# EAGLE design PDB (EAGLE 9.6.2)

## Sheet 1 of 2
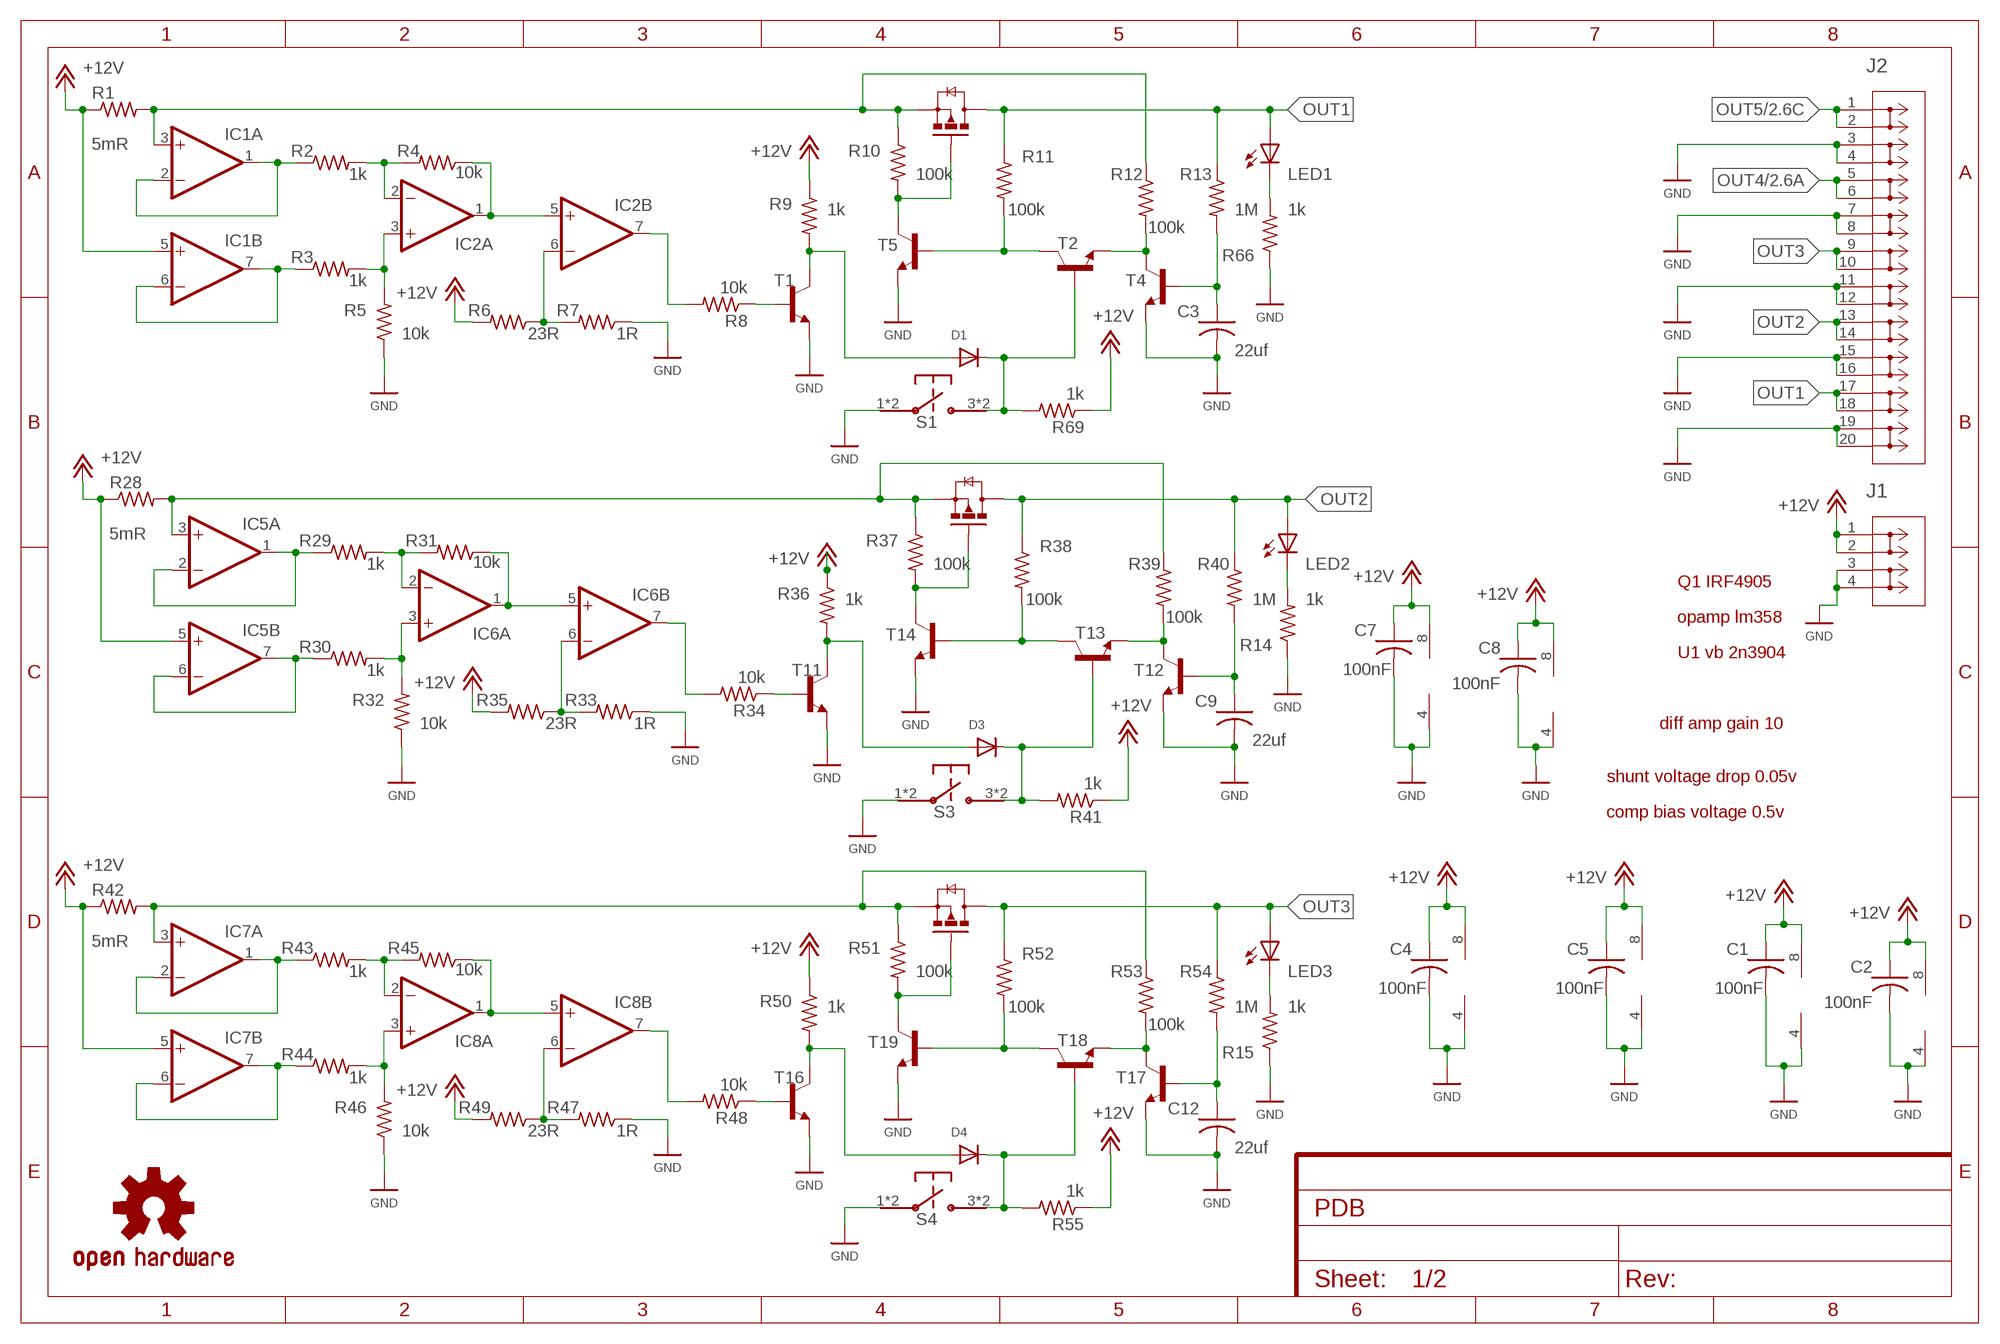
[diagram p0: schematic, sheet 1]

### Parts
C1  100nF  C-USC0603  [C0603]
C2  100nF  C-USC0603  [C0603]
C3  22uf  C-USC0805  [C0805]
C4  100nF  C-USC0603  [C0603]
C5  100nF  C-USC0603  [C0603]
C7  100nF  C-USC0603  [C0603]
C8  100nF  C-USC0603  [C0603]
C9  22uf  C-USC0805  [C0805]
C12  22uf  C-USC0805  [C0805]
D1  DIODESOD-323F  [SOD-323F]
D3  DIODESOD-323F  [SOD-323F]
D4  DIODESOD-323F  [SOD-323F]
IC1  LM358D  [SO08]
IC2  LM358D  [SO08]
IC5  LM358D  [SO08]
IC6  LM358D  [SO08]
IC7  LM358D  [SO08]
IC8  LM358D  [SO08]
J1  2606-1102  [CONN2_2606-1102_WAG]
J2  2604-1110  [CONN10_2604-1110_WAG]
LED1  LEDCHIP-LED0603  [CHIP-LED0603]
LED2  LEDCHIP-LED0603  [CHIP-LED0603]
LED3  LEDCHIP-LED0603  [CHIP-LED0603]
LOGO1  OSHW-LOGOL  [OSHW-LOGO-L]
R1  5mR  R-US_R2512  [R2512]
R2  1k  R-US_R0603  [R0603]
R3  1k  R-US_R0603  [R0603]
R4  10k  R-US_R0603  [R0603]
R5  10k  R-US_R0603  [R0603]
R6  23R  R-US_R0603  [R0603]
R7  1R  R-US_R0603  [R0603]
R8  10k  R-US_R0603  [R0603]
R9  1k  R-US_R0603  [R0603]
R10  100k  R-US_R0603  [R0603]
R11  100k  R-US_R0603  [R0603]
R12  100k  R-US_R0603  [R0603]
R13  1M  R-US_R0603  [R0603]
R14  1k  R-US_R0603  [R0603]
R15  1k  R-US_R0603  [R0603]
R28  5mR  R-US_R2512  [R2512]
R29  1k  R-US_R0603  [R0603]
R30  1k  R-US_R0603  [R0603]
R31  10k  R-US_R0603  [R0603]
R32  10k  R-US_R0603  [R0603]
R33  1R  R-US_R0603  [R0603]
R34  10k  R-US_R0603  [R0603]
R35  23R  R-US_R0603  [R0603]
R36  1k  R-US_R0603  [R0603]
R37  100k  R-US_R0603  [R0603]
R38  100k  R-US_R0603  [R0603]
R39  100k  R-US_R0603  [R0603]
R40  1M  R-US_R0603  [R0603]
R41  1k  R-US_R0603  [R0603]
R42  5mR  R-US_R2512  [R2512]
R43  1k  R-US_R0603  [R0603]
R44  1k  R-US_R0603  [R0603]
R45  10k  R-US_R0603  [R0603]
R46  10k  R-US_R0603  [R0603]
R47  1R  R-US_R0603  [R0603]
R48  10k  R-US_R0603  [R0603]
R49  23R  R-US_R0603  [R0603]
R50  1k  R-US_R0603  [R0603]
R51  100k  R-US_R0603  [R0603]
R52  100k  R-US_R0603  [R0603]
R53  100k  R-US_R0603  [R0603]
R54  1M  R-US_R0603  [R0603]
R55  1k  R-US_R0603  [R0603]
R66  1k  R-US_R0603  [R0603]
R69  1k  R-US_R0603  [R0603]
S1  PTS645SM43SMTR  [PTS645SM43SMTR]
S3  PTS645SM43SMTR  [PTS645SM43SMTR]
S4  PTS645SM43SMTR  [PTS645SM43SMTR]
T1  2N3904SMD  [SOT23-BACKUP]
T2  2N3904SMD  [SOT23-BACKUP]
T3  IRF4905  [TO263-3]
T4  2N3904SMD  [SOT23-BACKUP]
T5  2N3904SMD  [SOT23-BACKUP]
T11  2N3904SMD  [SOT23-BACKUP]
T12  2N3904SMD  [SOT23-BACKUP]
T13  2N3904SMD  [SOT23-BACKUP]
T14  2N3904SMD  [SOT23-BACKUP]
T15  IRF4905  [TO263-3]
T16  2N3904SMD  [SOT23-BACKUP]
T17  2N3904SMD  [SOT23-BACKUP]
T18  2N3904SMD  [SOT23-BACKUP]
T19  2N3904SMD  [SOT23-BACKUP]
T20  IRF4905  [TO263-3]

### Nets
+12V: C1.1 C2.1 C4.1 C5.1 C7.1 C8.1 IC1.5(B:+IN) IC1.8(P:V+) IC2.8(P:V+) IC5.5(B:+IN) IC5.8(P:V+) IC6.8(P:V+) IC7.5(B:+IN) IC7.8(P:V+) IC8.8(P:V+) J1.1(1_1) J1.2(1_2) R1.1 R6.2 R9.1 R28.1 R35.2 R36.1 R41.1 R42.1 R49.2 R50.1 R55.1 R69.1 ; also sheet 2
GND: C1.2 C2.2 C3.2 C4.2 C5.2 C7.2 C8.2 C9.2 C12.2 IC1.4(P:V-) IC2.4(P:V-) IC5.4(P:V-) IC6.4(P:V-) IC7.4(P:V-) IC8.4(P:V-) J1.3(2_1) J1.4(2_2) J2.3(2_1) J2.4(2_2) J2.7(4_1) J2.8(4_2) J2.11(6_1) J2.12(6_2) J2.15(8_1) J2.16(8_2) J2.19(10_1) J2.20(10_2) R5.1 R7.1 R14.1 R15.1 R32.1 R33.1 R46.1 R47.1 R66.1 S1.1 S1.2 S3.1 S3.2 S4.1 S4.2 T1.2(E) T4.2(E) T5.2(E) T11.2(E) T12.2(E) T14.2(E) T16.2(E) T17.2(E) T19.2(E) ; also sheet 2
N53: IC5.3(A:+IN) R28.2 R37.1 R39.1 T15.3(S)
N$1: LED2.C R14.2
N$2: IC1.1(A:OUT) IC1.2(A:-IN) R2.1
N$3: IC1.6(B:-IN) IC1.7(B:OUT) R3.1
N$4: IC2.1(A:OUT) IC2.5(B:+IN) R4.1
N$5: R8.1 T1.1(B)
N$6: IC2.7(B:OUT) R8.2
N$7: IC2.6(B:-IN) R6.1 R7.2
N$8: IC2.3(A:+IN) R3.2 R5.2
N$9: IC2.2(A:-IN) R2.2 R4.2
N$10: LED3.C R15.2
N$11: IC1.3(A:+IN) R1.2 R10.1 R12.1 T3.3(S)
N$12: R10.2 T3.1(G) T5.3(C)
N$14: R11.2 T2.3(C) T5.1(B)
N$15: C3.1 R13.2 T4.1(B)
N$18: R12.2 T2.2(E) T4.3(C)
N$27: LED1.C R66.2
N$30: IC5.1(A:OUT) IC5.2(A:-IN) R29.1
N$31: IC5.6(B:-IN) IC5.7(B:OUT) R30.1
N$32: IC6.6(B:-IN) R33.2 R35.1
N$33: IC6.3(A:+IN) R30.2 R32.2
N$34: IC6.2(A:-IN) R29.2 R31.2
N$35: IC6.1(A:OUT) IC6.5(B:+IN) R31.1
N$36: R34.1 T11.1(B)
N$37: IC6.7(B:OUT) R34.2
N$39: R37.2 T14.3(C) T15.1(G)
N$40: R38.2 T13.3(C) T14.1(B)
N$41: C9.1 R40.2 T12.1(B)
N$42: R39.2 T12.3(C) T13.2(E)
N$43: D3.C R41.2 S3.3 S3.4 T13.1(B)
N$44: D3.A R36.2 T11.3(C)
N$45: IC7.1(A:OUT) IC7.2(A:-IN) R43.1
N$46: IC7.6(B:-IN) IC7.7(B:OUT) R44.1
N$47: IC8.6(B:-IN) R47.2 R49.1
N$48: IC8.3(A:+IN) R44.2 R46.2
N$49: IC8.2(A:-IN) R43.2 R45.2
N$50: IC8.1(A:OUT) IC8.5(B:+IN) R45.1
N$51: R48.1 T16.1(B)
N$52: IC8.7(B:OUT) R48.2
N$53: IC7.3(A:+IN) R42.2 R51.1 R53.1 T20.3(S)
N$54: R51.2 T19.3(C) T20.1(G)
N$55: R52.2 T18.3(C) T19.1(B)
N$56: C12.1 R54.2 T17.1(B)
N$57: R53.2 T17.3(C) T18.2(E)
N$58: D4.C R55.2 S4.3 S4.4 T18.1(B)
N$59: D4.A R50.2 T16.3(C)
N$76: D1.C R69.2 S1.3 S1.4 T2.1(B)
N$77: D1.A R9.2 T1.3(C)
OUT1: J2.17(9_1) J2.18(9_2) LED1.A R11.1 R13.1 T3.4(D)
OUT2: J2.13(7_1) J2.14(7_2) LED2.A R38.1 R40.1 T15.4(D)
OUT3: J2.9(5_1) J2.10(5_2) LED3.A R52.1 R54.1 T20.4(D)
OUT4: J2.5(3_1) J2.6(3_2) ; also sheet 2
OUT5: J2.1(1_1) J2.2(1_2) ; also sheet 2

### Notes on the sheet
- Q1 IRF4905
- opamp lm358
- U1 vb 2n3904
- diff amp gain 10
- shunt voltage drop 0.05v
- comp bias voltage 0.5v

## Sheet 2 of 2
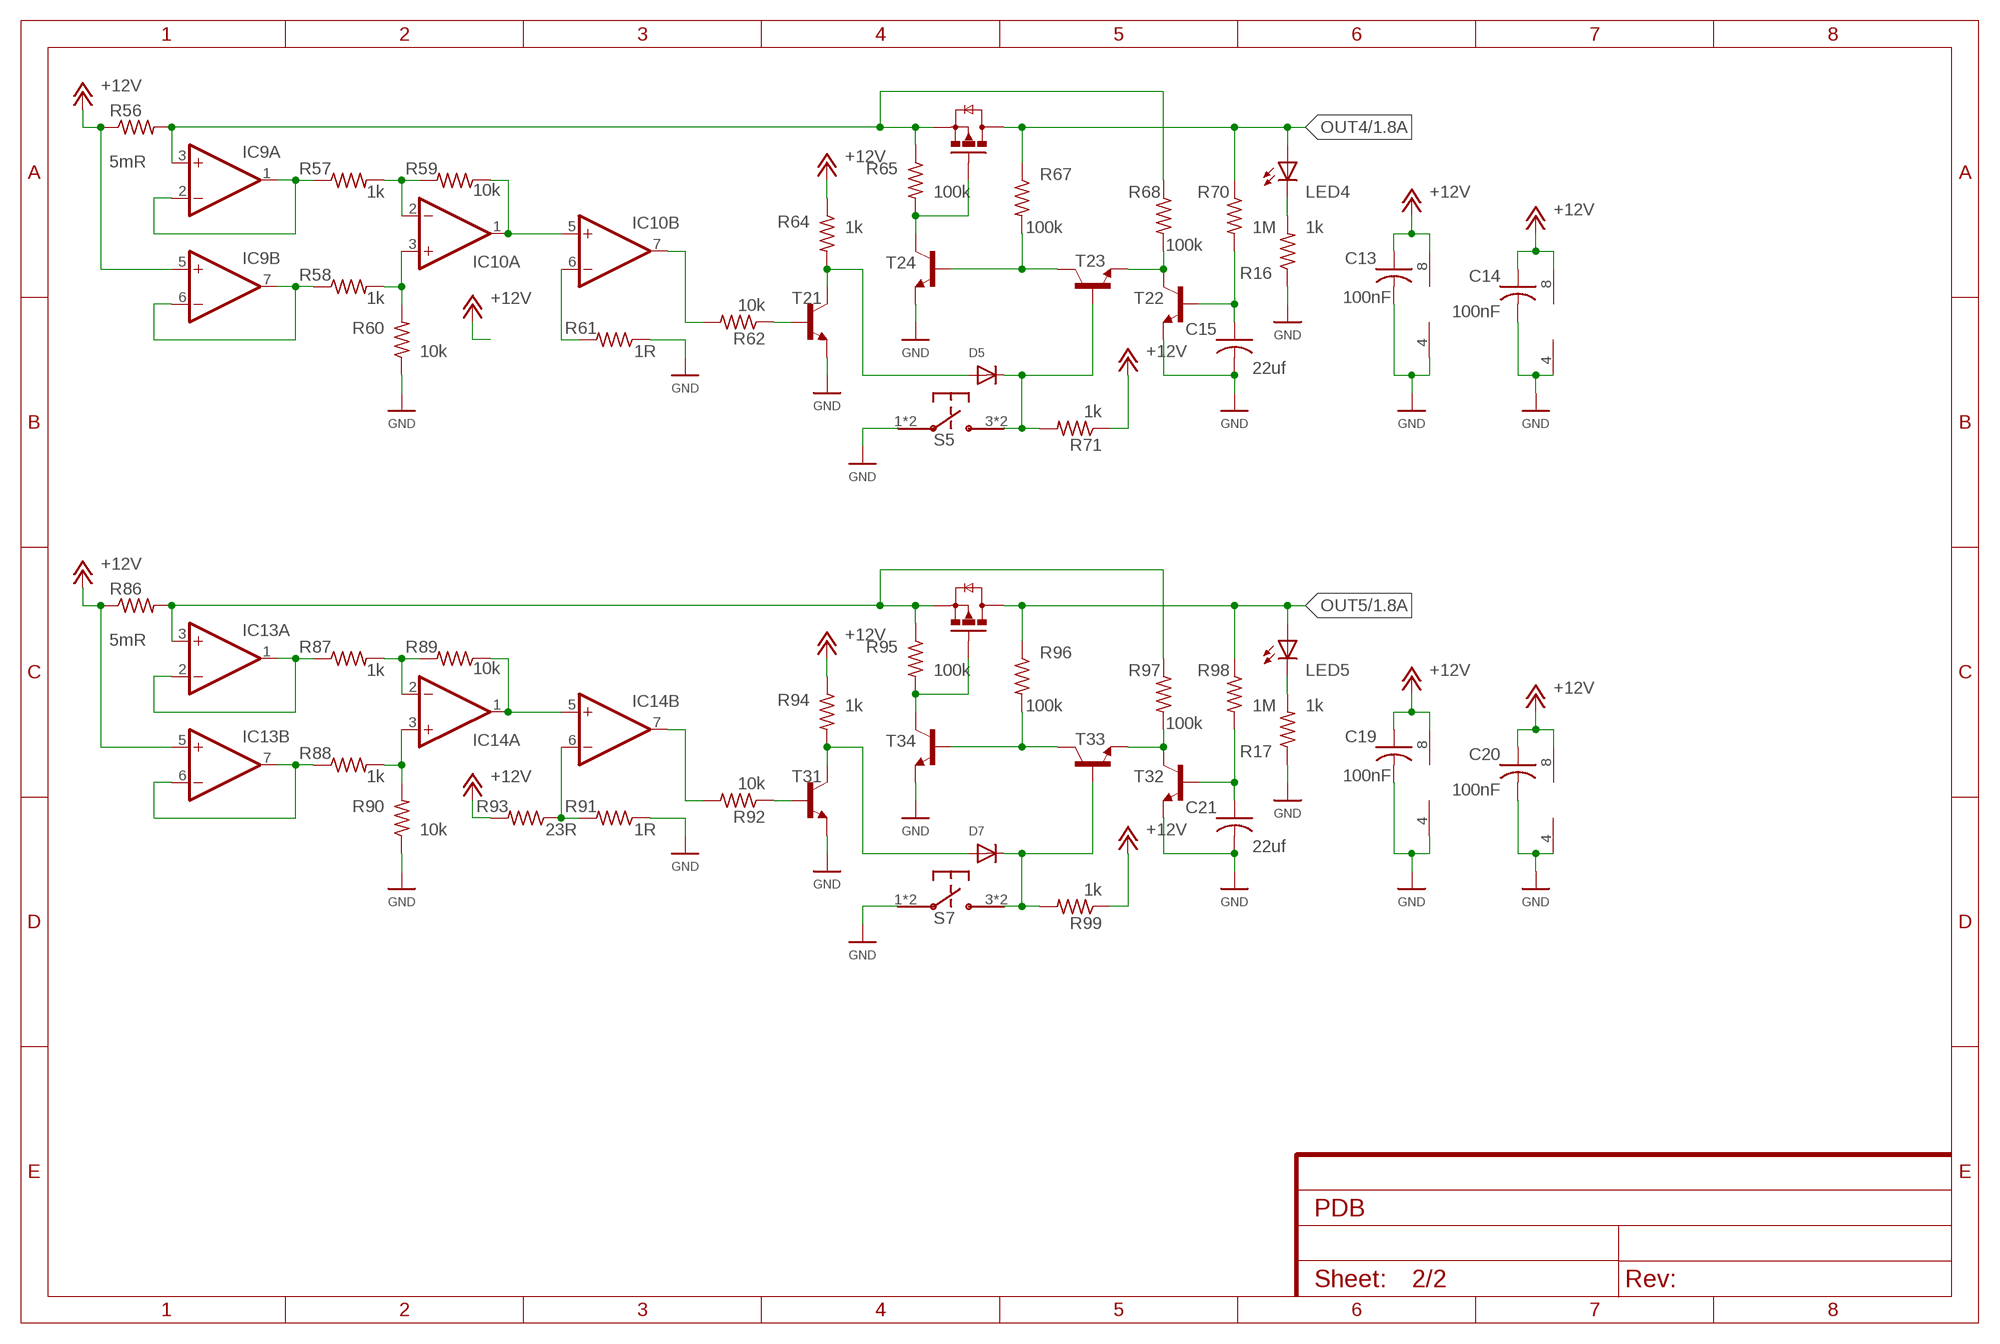
[diagram p1: schematic, sheet 2]

### Parts
C13  100nF  C-USC0603  [C0603]
C14  100nF  C-USC0603  [C0603]
C15  22uf  C-USC0805  [C0805]
C19  100nF  C-USC0603  [C0603]
C20  100nF  C-USC0603  [C0603]
C21  22uf  C-USC0805  [C0805]
D5  DIODESOD-323F  [SOD-323F]
D7  DIODESOD-323F  [SOD-323F]
IC9  LM358D  [SO08]
IC10  LM358D  [SO08]
IC13  LM358D  [SO08]
IC14  LM358D  [SO08]
LED4  LEDCHIP-LED0603  [CHIP-LED0603]
LED5  LEDCHIP-LED0603  [CHIP-LED0603]
R16  1k  R-US_R0603  [R0603]
R17  1k  R-US_R0603  [R0603]
R56  5mR  R-US_R2512  [R2512]
R57  1k  R-US_R0603  [R0603]
R58  1k  R-US_R0603  [R0603]
R59  10k  R-US_R0603  [R0603]
R60  10k  R-US_R0603  [R0603]
R61  1R  R-US_R0603  [R0603]
R62  10k  R-US_R0603  [R0603]
R64  1k  R-US_R0603  [R0603]
R65  100k  R-US_R0603  [R0603]
R67  100k  R-US_R0603  [R0603]
R68  100k  R-US_R0603  [R0603]
R70  1M  R-US_R0603  [R0603]
R71  1k  R-US_R0603  [R0603]
R86  5mR  R-US_R2512  [R2512]
R87  1k  R-US_R0603  [R0603]
R88  1k  R-US_R0603  [R0603]
R89  10k  R-US_R0603  [R0603]
R90  10k  R-US_R0603  [R0603]
R91  1R  R-US_R0603  [R0603]
R92  10k  R-US_R0603  [R0603]
R93  23R  R-US_R0603  [R0603]
R94  1k  R-US_R0603  [R0603]
R95  100k  R-US_R0603  [R0603]
R96  100k  R-US_R0603  [R0603]
R97  100k  R-US_R0603  [R0603]
R98  1M  R-US_R0603  [R0603]
R99  1k  R-US_R0603  [R0603]
S5  PTS645SM43SMTR  [PTS645SM43SMTR]
S7  PTS645SM43SMTR  [PTS645SM43SMTR]
T21  2N3904SMD  [SOT23-BACKUP]
T22  2N3904SMD  [SOT23-BACKUP]
T23  2N3904SMD  [SOT23-BACKUP]
T24  2N3904SMD  [SOT23-BACKUP]
T25  IRF4905  [TO263-3]
T31  2N3904SMD  [SOT23-BACKUP]
T32  2N3904SMD  [SOT23-BACKUP]
T33  2N3904SMD  [SOT23-BACKUP]
T34  2N3904SMD  [SOT23-BACKUP]
T35  IRF4905  [TO263-3]

### Nets
+12V: C13.1 C14.1 C19.1 C20.1 IC9.5(B:+IN) IC9.8(P:V+) IC10.8(P:V+) IC13.5(B:+IN) IC13.8(P:V+) IC14.8(P:V+) R56.1 R64.1 R71.1 R86.1 R93.2 R94.1 R99.1 ; also sheet 1
GND: C13.2 C14.2 C15.2 C19.2 C20.2 C21.2 IC9.4(P:V-) IC10.4(P:V-) IC13.4(P:V-) IC14.4(P:V-) R16.1 R17.1 R60.1 R61.1 R90.1 R91.1 S5.1 S5.2 S7.1 S7.2 T21.2(E) T22.2(E) T24.2(E) T31.2(E) T32.2(E) T34.2(E) ; also sheet 1
N$13: LED4.C R16.2
N$16: LED5.C R17.2
N$60: IC9.1(A:OUT) IC9.2(A:-IN) R57.1
N$61: IC9.6(B:-IN) IC9.7(B:OUT) R58.1
N$62: IC10.6(B:-IN) R61.2
N$63: IC10.3(A:+IN) R58.2 R60.2
N$64: IC10.2(A:-IN) R57.2 R59.2
N$65: IC10.1(A:OUT) IC10.5(B:+IN) R59.1
N$66: R62.1 T21.1(B)
N$67: IC10.7(B:OUT) R62.2
N$68: IC9.3(A:+IN) R56.2 R65.1 R68.1 T25.3(S)
N$69: R65.2 T24.3(C) T25.1(G)
N$70: R67.2 T23.3(C) T24.1(B)
N$71: C15.1 R70.2 T22.1(B)
N$72: R68.2 T22.3(C) T23.2(E)
N$73: D5.C R71.2 S5.3 S5.4 T23.1(B)
N$74: D5.A R64.2 T21.3(C)
N$92: IC13.1(A:OUT) IC13.2(A:-IN) R87.1
N$93: IC13.6(B:-IN) IC13.7(B:OUT) R88.1
N$94: IC14.6(B:-IN) R91.2 R93.1
N$95: IC14.3(A:+IN) R88.2 R90.2
N$96: IC14.2(A:-IN) R87.2 R89.2
N$97: IC14.1(A:OUT) IC14.5(B:+IN) R89.1
N$98: R92.1 T31.1(B)
N$99: IC14.7(B:OUT) R92.2
N$100: IC13.3(A:+IN) R86.2 R95.1 R97.1 T35.3(S)
N$101: R95.2 T34.3(C) T35.1(G)
N$102: R96.2 T33.3(C) T34.1(B)
N$103: C21.1 R98.2 T32.1(B)
N$104: R97.2 T32.3(C) T33.2(E)
N$105: D7.C R99.2 S7.3 S7.4 T33.1(B)
N$106: D7.A R94.2 T31.3(C)
OUT4: LED4.A R67.1 R70.1 T25.4(D) ; also sheet 1
OUT5: LED5.A R96.1 R98.1 T35.4(D) ; also sheet 1

## Library data of the parts
C1-C5 C7-C9 C12-C15 C19-C21 = rcl:C-US: CAPACITOR, American symbol; SPICEPREFIX: C
D1 D3-D5 D7 = adafruit:DIODE: Diode SMADIODE - SMA Surface Mount Package 20V 1A Schottky Diode Digikey: 641-1014-6-ND DO-1N4148 - Through Hole Small Current Diode SOD-123 20V 1 A (.5mV Vf) Schottky Diode - Digikey: MBRX120TPMSCT-ND SOD-323 10V 570mA (.38mV Vf, 3ns) Schottky Diode - Digikey: ZLLS410CT-ND SOD-523 30V 30mA Schottky Diode (RB751S-40TE61) - Digikey: RB751S-40TE61CT-ND SOT23-R/W - SOT23 Package (R = Solder Paste/Reflow Ovens, W = Hand-Soldering) BAT54Film 40V 300mA - Digikey: 497-7162-1-ND
IC1 IC2 IC5-IC10 IC13 IC14 = linear:LM358: OP AMP also LM158; LM258; LM2904 Source: http://cache.national.com/ds/LM/LM158.pdf
J1 = wago 2606-1102:2606-1102; COPYRIGHT: Copyright (C) 2024 Ultra Librarian. All rights reserved.; MANUFACTURER_PART_NUMBER: 2606-1102; MFR_NAME: Wago
J2 = wago 2604-110:2604-1110; COPYRIGHT: Copyright (C) 2024 Ultra Librarian. All rights reserved.; MANUFACTURER_PART_NUMBER: 2604-1110; MFR_NAME: Wago
LED1-LED5 = adafruit:LED: LED OSRAM: - CHIPLED LG R971, LG N971, LY N971, LG Q971, LY Q971, LO R971, LY R971 LH N974, LH R974 LS Q976, LO Q976, LY Q976 LO Q996 - Hyper CHIPLED LW Q18S LB Q993, LB Q99A, LB R99A - SideLED LS A670, LO A670, LY A670, LG A670, LP A670 LB A673, LV A673, LT A673, LW A673 LH A674 LY A675 LS A676, LA A676, LO A676, LY A676, LW A676 LS A679, LY A679, LG A679 - Hyper Micro SIDELED® LS Y876, LA Y876, LO Y876, LY Y876 LT Y87S - SmartLED LW L88C, LW L88S LB L89C, LB L89S, LG L890 LS L89K, LO L89K, LY L89K LS L896, LA L896, LO L896, LY L896 - TOPLED LS T670, LO T670, LY T670, LG T670, LP T670 LSG T670, LSP T670, LSY T670, LOP T670, LYG T670 LG T671, LOG T671, LSG T671 LB T673, LV T673, LT T673, LW T673 LH T674 LS T676, LA T676, LO T676, LY T676, LB T676, LH T676, LSB T676, LW T676 LB T67C, LV T67C, LT T67C, LS T67K, LO T67K, LY T67K, LW E67C LS E67B, LA E67B, LO E67B, LY E67B, LB E67C, LV E67C, LT E67C LW T67C LS T679, LY T679, LG T679 LS T770, LO T770, LY T770, LG T770, LP T770 LB T773, LV T773, LT T773, LW T773 LH T774 LS E675, LA E675, LY E675, LS T675 LS T776, LA T776, LO T776, LY T776, LB T776 LHGB T686 LT T68C, LB T68C - Hyper Mini TOPLED® LB M676 - Mini TOPLED Santana® LG M470 LS M47K, LO M47K, LY M47K Source: http://www.osram.convergy.de/
LOGO1 = SparkFun-Aesthetics:OSHW-LOGO: Open-Source Hardware (OSHW) Logo This logo indicates the piece of hardware it is found on incorporates a OSHW license and/or adheres to the definition of open source hardware found here: http://freedomdefined.org/OSHW
R1-R17 R28-R62 R64-R71 R86-R99 = rcl:R-US_: RESISTOR, American symbol; SPICEPREFIX: R
S1 S3-S5 S7 = switches:PTS645SM43SMTR: SWITCH TACTILE SPST-NO 0.05A 12V; DIGIKEY: CKN9112CT-ND
T1 T2 T4 T5 T11-T14 T16-T19 T21-T24 T31-T34 = 2n3904sot:2N3904SMD
T3 T15 T20 T25 T35 = IRF4905:IRF4905

## Board
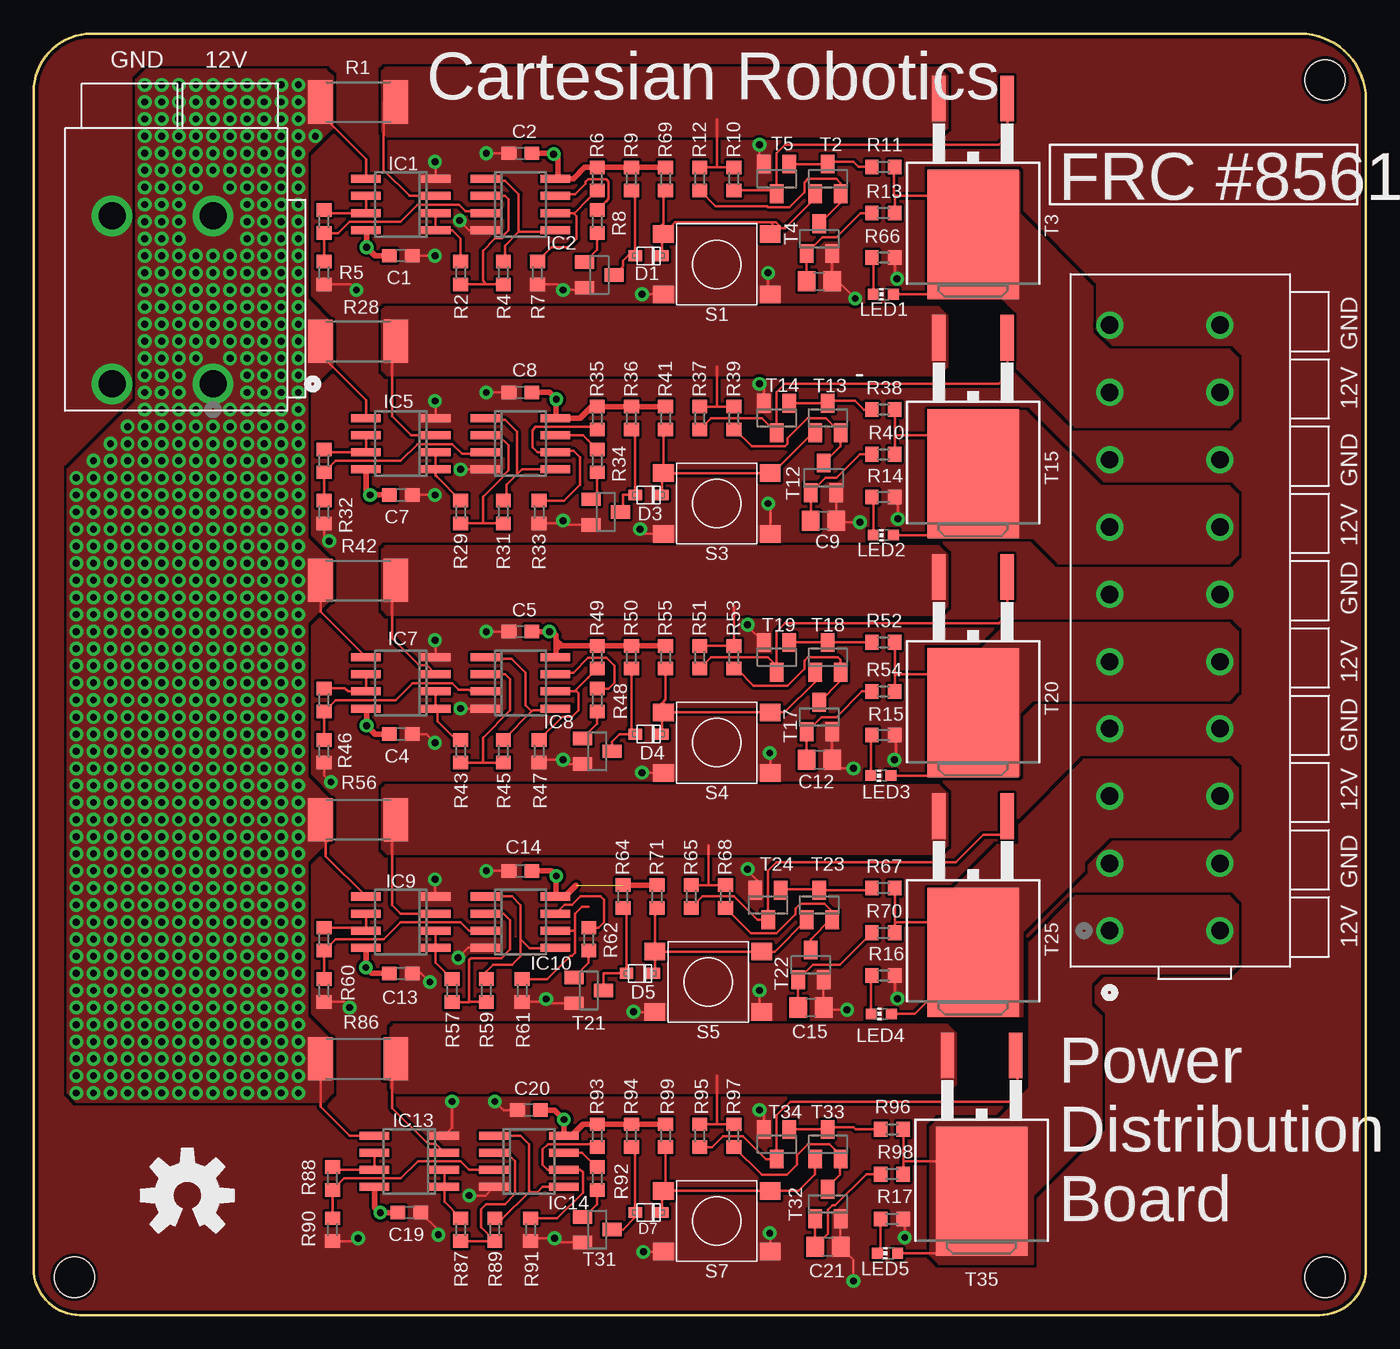
[diagram p2: board, top side]
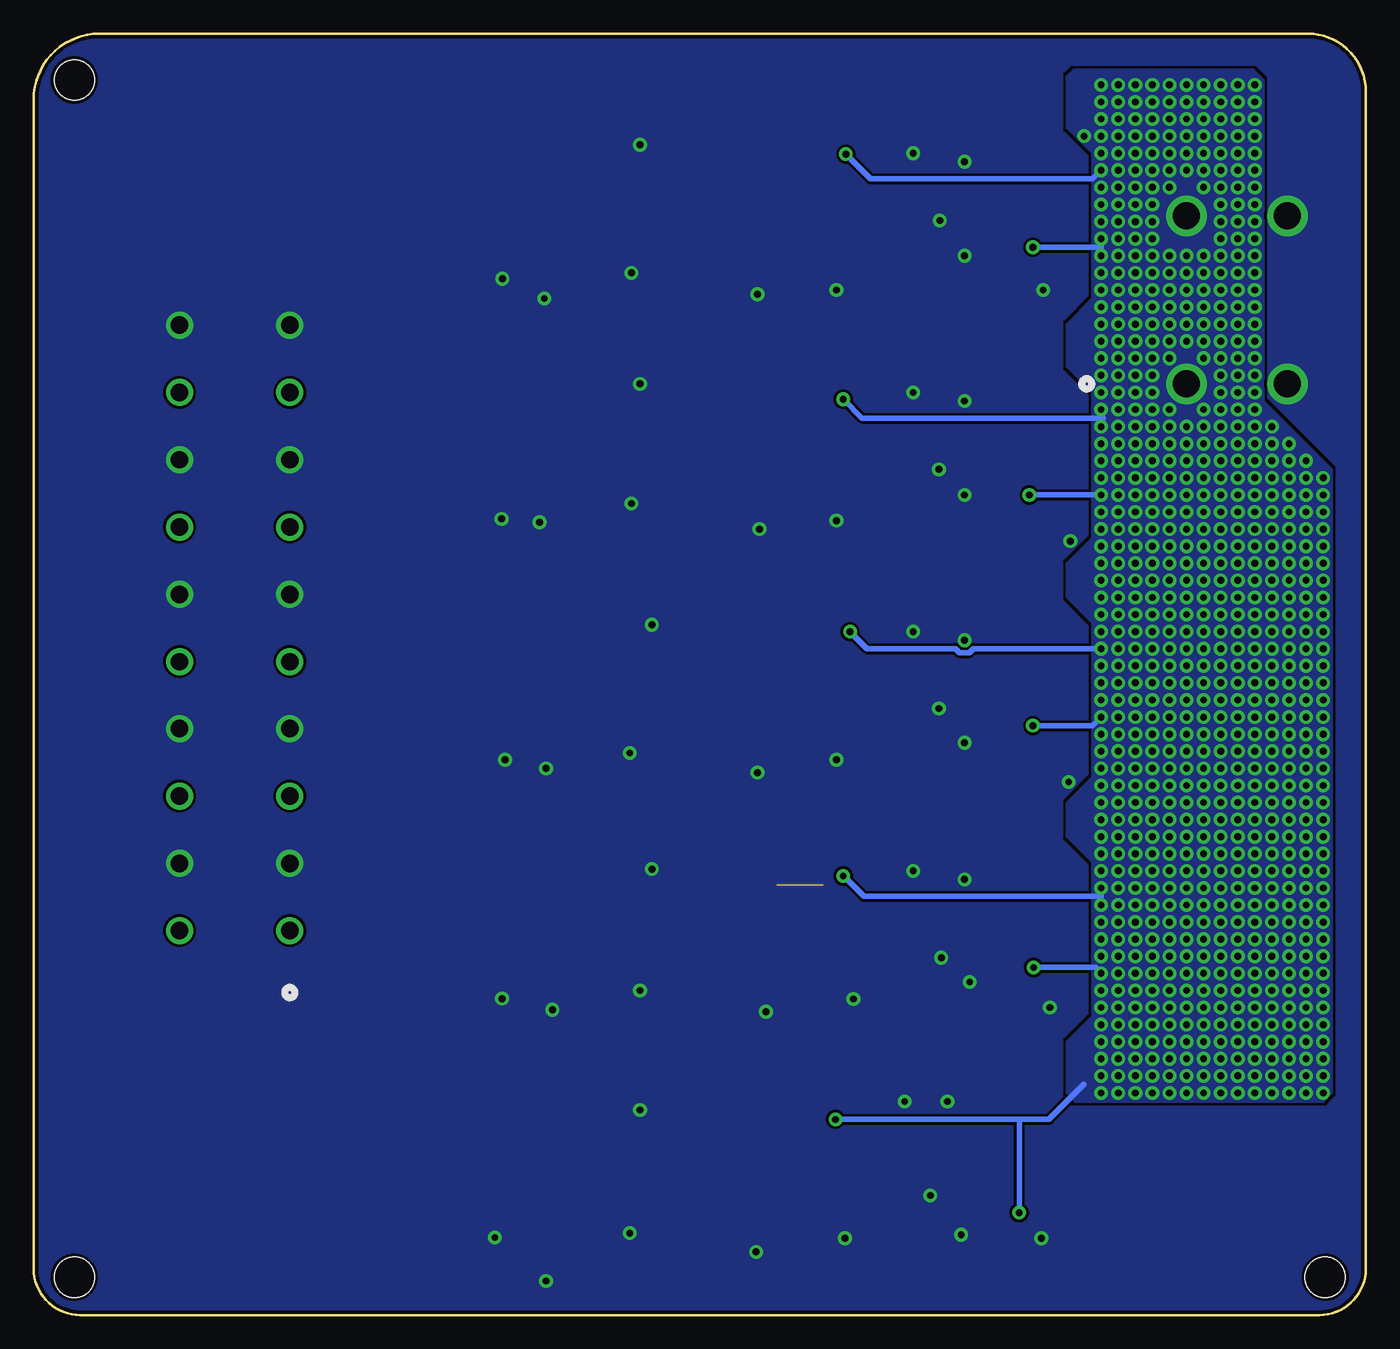
[diagram p3: board, bottom side, seen from below]

Size 99.06 x 95.25 mm. Coordinates in mm from the lower left corner, seen from the top.
Outline: 95.59,0 3.46,0 arc-90 0,3.46 0,90.92 arc-90 4.33,95.25 94.17,95.25 arc-90 99.06,90.36 99.06,3.47 arc-90 95.59,0
Copper layers (1*16): Top 0.035mm / dielectric 1.5mm / Bottom 0.035mm
Design rules "default": minimum track width 8mil, minimum drill 20mil, track to track 8mil, track to pad 8mil, pad to pad 8mil, via to via 8mil, smd to smd 8mil, copper to edge 10mil, drill to drill 8mil, minimum pad ring 12mil, minimum via ring 10mil, stop-mask expansion 4mil, vias tented up to drill 25mil, thermal gap 10mil
Holes 3 mm at 96.03,2.81 3.03,2.81 96.03,91.81

### Footprints (pad centres in the part's own frame; a part is rotated, then mirrored left to right if it is on the bottom)
C0603 = smd 1.1 x 1: 1 -0.85,0; 2 0.85,0
C0805 = smd 1.3 x 1.5: 1 -0.95,0; 2 0.95,0
SOD-323F = smd 1 x 0.8: A -1,0; C 1,0
SO08 = smd 0.6 x 2.2: 1 -1.905,-2.6; 2 -0.635,-2.6; 3 0.635,-2.6; 4 1.905,-2.6; 5 1.905,2.6; 6 0.635,2.6; 7 -0.635,2.6; 8 -1.905,2.6
CONN2_2606-1102_WAG = drill 2.007 pad 2.692: 1 0,0; 2 0,-12.497; 3 7.493,0; 4 7.493,-12.497
CONN10_2604-1110_WAG = drill 1.295 pad 2.007: 1 0,0; 2 0,-8.204; 3 5.004,0; 4 5.004,-8.204; 5 10.008,0; 6 10.008,-8.204; 7 15.011,0; 8 15.011,-8.204; 9 19.99,0; 10 19.99,-8.204; 11 24.994,0; 12 24.994,-8.204; 13 29.997,0; 14 29.997,-8.204; 15 35.001,0; 16 35.001,-8.204; 17 40.005,0; 18 40.005,-8.204; 19 45.009,0; 20 45.009,-8.204
CHIP-LED0603 = smd 0.8 x 0.8: A 0,-0.75; C 0,0.75
R2512 = smd 1.8 x 3.2: 1 -2.8,0; 2 2.8,0
R0603 = smd 1 x 1.1: 1 -0.85,0; 2 0.85,0
PTS645SM43SMTR = smd 1.55 x 1.3: 1 -3.975,2.25; 2 3.975,2.25; 3 -3.975,-2.25; 4 3.975,-2.25
SOT23-BACKUP = smd 1 x 1.4: 1 -0.95,-1.1; 2 0.95,-1.1; 3 0,1.1
TO263-3 = smd 1 x 3.4: 1 -2.54,-9.14; 3 2.54,-9.14 | smd 6.8 x 9.6: 4 0,0.96

### Placement (x,y rotation side)
C1  27.3,78.74 0 top
C2  36.2,86.36 180 top
C3  58.42,76.84 0 top
C4  27.3,43.18 0 top
C5  36.2,50.8 180 top
C7  27.3,60.96 0 top
C8  36.2,68.58 180 top
C9  58.74,59.05 0 top
C12  58.42,41.28 0 top
C13  27.3,25.4 0 top
C14  36.2,33.02 180 top
C15  57.78,22.86 0 top
C19  27.94,7.62 0 top
C20  36.83,15.24 180 top
C21  59.06,5.08 0 top
D1  45.72,78.74 0 top
D3  45.72,60.96 0 top
D4  45.72,43.18 0 top
D5  45.09,25.4 0 top
D7  45.72,7.62 0 top
IC1  27.3,82.55 90 top
IC2  36.2,82.55 270 top
IC5  27.3,64.77 90 top
IC6  36.2,64.77 270 top
IC7  27.3,46.99 90 top
IC8  36.2,46.99 270 top
IC9  27.3,29.21 90 top
IC10  36.2,29.21 270 top
IC13  27.94,11.43 90 top
IC14  36.83,11.43 270 top
J1  13.33,69.22 180 top
J2  80.01,28.57 90 top
LED1  63.18,75.88 90 top
LED2  63.18,57.98 90 top
LED3  62.99,40.1 90 top
LED4  63.02,22.38 90 top
LED5  63.5,4.6 90 top
LOGO1  11.43,8.89 0 top
R1  24.13,90.17 0 top
R2  31.75,77.47 270 top
R3  21.59,81.28 270 top
R4  34.93,77.47 270 top
R5  21.59,77.47 90 top
R6  41.91,84.45 90 top
R7  37.47,77.47 90 top
R8  41.91,81.28 90 top
R9  44.45,84.45 270 top
R10  52.07,84.45 270 top
R11  63.18,85.34 180 top
R12  49.53,84.45 270 top
R13  63.18,81.92 180 top
R14  63.18,60.8 180 top
R15  63.18,43.12 180 top
R16  63.18,25.24 180 top
R17  63.82,7.14 180 top
R28  24.13,72.39 0 top
R29  31.75,59.69 270 top
R30  21.59,63.5 270 top
R31  34.93,59.69 270 top
R32  21.59,59.69 90 top
R33  37.59,59.69 90 top
R34  41.91,63.5 90 top
R35  41.91,66.67 90 top
R36  44.45,66.67 270 top
R37  49.53,66.67 270 top
R38  63.18,67.31 180 top
R39  52.07,66.67 270 top
R40  63.18,63.98 180 top
R41  46.99,66.67 270 top
R42  24.13,54.61 0 top
R43  31.75,41.91 270 top
R44  21.59,45.72 270 top
R45  34.93,41.91 270 top
R46  21.59,41.91 90 top
R47  37.59,41.91 90 top
R48  41.91,45.72 90 top
R49  41.91,48.9 90 top
R50  44.45,48.9 270 top
R51  49.53,48.9 270 top
R52  63.18,50.01 180 top
R53  52.07,48.9 270 top
R54  63.18,46.36 180 top
R55  46.99,48.9 270 top
R56  24.13,36.83 0 top
R57  31.12,24.13 270 top
R58  21.59,27.94 270 top
R59  33.66,24.13 270 top
R60  21.59,24.13 90 top
R61  36.32,24.13 90 top
R62  41.27,27.94 90 top
R64  43.81,31.11 270 top
R65  48.9,31.11 270 top
R66  63.18,78.61 180 top
R67  63.18,31.75 180 top
R68  51.44,31.11 270 top
R69  46.99,84.45 270 top
R70  63.18,28.42 180 top
R71  46.36,31.11 270 top
R86  24.13,19.05 0 top
R87  31.75,6.35 270 top
R88  22.23,10.16 270 top
R89  34.29,6.35 270 top
R90  22.23,6.35 90 top
R91  36.96,6.35 90 top
R92  41.91,10.16 90 top
R93  41.91,13.34 90 top
R94  44.45,13.34 270 top
R95  49.53,13.34 270 top
R96  63.82,13.81 180 top
R97  52.07,13.34 270 top
R98  63.82,10.48 180 top
R99  46.99,13.34 270 top
S1  50.8,78.11 180 top
S3  50.8,60.33 180 top
S4  50.8,42.55 180 top
S5  50.17,24.76 180 top
S7  50.8,6.98 180 top
T1  42.07,77.31 270 top
T2  59.06,84.45 0 top
T3  69.85,81.28 180 top
T4  58.42,80.01 0 top
T5  55.25,84.45 180 top
T11  42.55,59.69 270 top
T12  58.74,62.23 0 top
T13  59.06,66.67 0 top
T14  55.25,66.67 180 top
T15  69.85,63.5 180 top
T16  41.91,41.91 270 top
T17  58.42,44.45 0 top
T18  59.06,48.9 0 top
T19  55.25,48.9 180 top
T20  69.85,45.72 180 top
T21  41.27,24.13 270 top
T22  57.78,26.04 0 top
T23  58.42,30.48 0 top
T24  54.61,30.48 180 top
T25  69.85,27.94 180 top
T31  41.91,6.35 270 top
T32  59.06,8.26 0 top
T33  59.06,12.7 0 top
T34  55.25,12.7 180 top
T35  70.48,10.16 180 top

### Tracks (layer width: path | path; a pad name or v marks a point on that pad's centre or on a via)
+12V  (via drill 0.51)  (1 unrouted)
  Top 0.203: 38.86,84.52 IC2.8 | IC5.5 24.7,68 21.33,71.38 R28.1 | 38.86,66.74 IC6.8 | 38.86,31.18 IC10.8 39.5,31.11 | IC9.5 21.72,34.1 21.72,36.07 21.33,36.46 R56.1 | IC13.5 23.5,13.34 21.33,15.5 R86.1 | IC7.5 21.33,52.27 R42.1 | IC1.5 24.7,85.91 21.84,88.77 21.72,88.77
  Top 0.406: IC1.8 24.77,80.59 v24.77,79.38 25.4,78.74 C1.1 | R69.1 R9.1 R6.2 40.98,85.31 40.13,84.45 IC2.8 | 38.86,84.52 38.99,84.65 38.99,85.98 v38.67,86.3 38.61,86.36 C2.1 | R41.1 R36.1 R35.2 41.49,67.53 40.64,66.67 38.93,66.67 38.86,66.74 v38.86,68.07 38.35,68.58 C8.1 | IC5.8 24.7,61.27 v25.02,60.96 C7.1 | IC7.8 24.77,45.03 v24.77,43.82 25.4,43.18 C4.1 | C5.1 v38.35,50.8 38.61,50.8 38.86,50.55 38.86,50.16 | 38.86,50.16 38.86,49.53 | 38.86,49.53 38.86,48.96 IC8.8 | 39.28,49.75 38.86,50.16 | 39.28,49.75 R49.2 R50.1 R55.1 | 39.28,49.75 39.08,49.75 38.86,49.53 | IC9.8 v24.7,25.84 25.15,25.4 C13.1 | R71.1 R64.1 | 39.5,31.11 40.35,31.96 | C14.1 38.48,33.02 v38.86,32.64 38.86,31.18 | R99.1 R94.1 R93.2 40.86,14.19 40.01,13.34 IC14.8 v39.43,14.54 38.73,15.24 C20.1 | C19.1 v25.78,7.62 25.37,8.03 25.37,9.49 IC13.8
  Bottom 0.406: v39.43,14.54 25.78,14.54 | 25.78,14.54 23.55,14.54 20.95,17.14 | v25.78,7.62 25.78,14.54 | v24.77,43.82 20.32,43.82 v19.69,44.45 | v38.35,50.8 37.08,49.53 30.5,49.53 30.22,49.25 29.47,49.25 29.19,49.53 v19.69,49.53 | v25.02,60.96 v19.69,60.96 | v38.86,68.07 37.47,66.67 19.53,66.67 | v38.67,86.3 36.83,84.45 20.32,84.45 v19.69,85.09 | v38.86,32.64 37.34,31.11 19.69,31.11 | v24.7,25.84 20.13,25.84 v19.69,25.4 | v24.77,79.38 19.69,79.38
  other vias: 19.69,16.51 18.41,16.51 17.14,16.51 15.87,16.51 14.6,16.51 13.33,16.51 12.06,16.51 10.79,16.51 9.53,16.51 8.26,16.51 6.98,16.51 5.71,16.51 4.44,16.51 3.17,16.51 3.17,17.78 4.44,17.78 5.71,17.78 6.98,17.78 8.26,17.78 9.53,17.78 10.79,17.78 12.06,17.78 13.33,17.78 14.6,17.78 15.87,17.78 17.14,17.78 18.41,17.78 19.69,17.78 3.17,19.05 4.44,19.05 5.71,19.05 6.98,19.05 8.26,19.05 9.53,19.05 10.79,19.05 12.06,19.05 13.33,19.05 14.6,19.05 15.87,19.05 17.14,19.05 18.41,19.05 19.69,19.05 3.17,20.32 4.44,20.32 5.71,20.32 6.98,20.32 8.26,20.32 9.53,20.32 10.79,20.32 12.06,20.32 13.33,20.32 14.6,20.32 15.87,20.32 17.14,20.32 18.41,20.32 19.69,20.32 3.17,36.83 4.44,36.83 5.71,36.83 6.98,36.83 8.26,36.83 9.53,36.83 10.79,36.83 12.06,36.83 13.33,36.83 14.6,36.83 15.87,36.83 17.14,36.83 18.41,36.83 19.69,36.83 3.17,21.59 4.44,21.59 5.71,21.59 6.98,21.59 8.26,21.59 9.53,21.59 10.79,21.59 12.06,21.59 13.33,21.59 14.6,21.59 15.87,21.59 17.14,21.59 18.41,21.59 19.69,21.59 3.17,22.86 4.44,22.86 5.71,22.86 6.98,22.86 8.26,22.86 9.53,22.86 10.79,22.86 12.06,22.86 13.33,22.86 14.6,22.86 15.87,22.86 17.14,22.86 18.41,22.86 19.69,22.86 3.17,24.13 4.44,24.13 5.71,24.13 6.98,24.13 8.26,24.13 9.53,24.13 10.79,24.13 12.06,24.13 13.33,24.13 14.6,24.13 15.87,24.13 17.14,24.13 18.41,24.13 19.69,24.13 3.17,25.4 4.44,25.4 5.71,25.4 6.98,25.4 8.26,25.4 9.53,25.4 10.79,25.4 12.06,25.4 13.33,25.4 14.6,25.4 15.87,25.4 17.14,25.4 18.41,25.4 3.17,26.67 4.44,26.67 5.71,26.67 6.98,26.67 8.26,26.67 9.53,26.67 10.79,26.67 12.06,26.67 13.33,26.67 14.6,26.67 15.87,26.67 17.14,26.67 18.41,26.67 19.69,26.67 3.17,27.94 4.44,27.94 5.71,27.94 6.98,27.94 8.26,27.94 9.53,27.94 10.79,27.94 12.06,27.94 13.33,27.94 14.6,27.94 15.87,27.94 17.14,27.94 18.41,27.94 19.69,27.94 3.17,29.21 4.44,29.21 5.71,29.21 6.98,29.21 8.26,29.21 9.53,29.21 10.79,29.21 12.06,29.21 13.33,29.21 14.6,29.21 15.87,29.21 17.14,29.21 18.41,29.21 19.69,29.21 3.17,30.48 4.44,30.48 5.71,30.48 6.98,30.48 8.26,30.48 9.53,30.48 10.79,30.48 12.06,30.48 13.33,30.48 14.6,30.48 15.87,30.48 17.14,30.48 18.41,30.48 19.69,30.48 3.17,31.75 4.44,31.75 5.71,31.75 6.98,31.75 8.26,31.75 9.53,31.75 10.79,31.75 12.06,31.75 13.33,31.75 14.6,31.75 15.87,31.75 17.14,31.75 18.41,31.75 19.69,31.75 3.17,33.02 4.44,33.02 5.71,33.02 6.98,33.02 8.26,33.02 9.53,33.02 10.79,33.02 12.06,33.02 13.33,33.02 14.6,33.02 15.87,33.02 17.14,33.02 18.41,33.02 19.69,33.02 3.17,34.29 4.44,34.29 5.71,34.29 6.98,34.29 8.26,34.29 9.53,34.29 10.79,34.29 12.06,34.29 13.33,34.29 14.6,34.29 15.87,34.29 17.14,34.29 18.41,34.29 19.69,34.29 3.17,35.56 4.44,35.56 5.71,35.56 6.98,35.56 8.26,35.56 9.53,35.56 10.79,35.56 12.06,35.56 13.33,35.56 14.6,35.56 15.87,35.56 17.14,35.56 18.41,35.56 19.69,35.56 3.17,38.1 4.44,38.1 5.71,38.1 6.98,38.1 8.26,38.1 9.53,38.1 10.79,38.1 12.06,38.1 13.33,38.1 14.6,38.1 15.87,38.1 17.14,38.1 18.41,38.1 19.69,38.1 3.17,39.37 4.44,39.37 5.71,39.37 6.98,39.37 8.26,39.37 9.53,39.37 10.79,39.37 12.06,39.37 13.33,39.37 14.6,39.37 15.87,39.37 17.14,39.37 18.41,39.37 19.69,39.37 3.17,40.64 4.44,40.64 5.71,40.64 6.98,40.64 8.26,40.64 9.53,40.64 10.79,40.64 12.06,40.64 13.33,40.64 14.6,40.64 15.87,40.64 17.14,40.64 18.41,40.64 19.69,40.64 3.17,41.91 4.44,41.91 5.71,41.91 6.98,41.91 8.26,41.91 9.53,41.91 10.79,41.91 12.06,41.91 13.33,41.91 14.6,41.91 15.87,41.91 17.14,41.91 18.41,41.91 19.69,41.91 3.17,43.18 4.44,43.18 5.71,43.18 6.98,43.18 8.26,43.18 9.53,43.18 10.79,43.18 12.06,43.18 13.33,43.18 14.6,43.18 15.87,43.18 17.14,43.18 18.41,43.18 19.69,43.18 3.17,44.45 4.44,44.45 5.71,44.45 6.98,44.45 8.26,44.45 9.53,44.45 10.79,44.45 12.06,44.45 13.33,44.45 14.6,44.45 15.87,44.45 17.14,44.45 18.41,44.45 3.17,45.72 4.44,45.72 5.71,45.72 6.98,45.72 8.26,45.72 9.53,45.72 10.79,45.72 12.06,45.72 13.33,45.72 14.6,45.72 15.87,45.72 17.14,45.72 18.41,45.72 19.69,45.72 3.17,46.99 4.44,46.99 5.71,46.99 6.98,46.99 8.26,46.99 9.53,46.99 10.79,46.99 12.06,46.99 13.33,46.99 14.6,46.99 15.87,46.99 17.14,46.99 18.41,46.99 19.69,46.99 3.17,48.26 4.44,48.26 5.71,48.26 6.98,48.26 8.26,48.26 9.53,48.26 10.79,48.26 12.06,48.26 13.33,48.26 14.6,48.26 15.87,48.26 17.14,48.26 18.41,48.26 19.69,48.26 3.17,49.53 4.44,49.53 5.71,49.53 6.98,49.53 8.26,49.53 9.53,49.53 10.79,49.53 12.06,49.53 13.33,49.53 14.6,49.53 15.87,49.53 17.14,49.53 18.41,49.53 3.17,50.8 4.44,50.8 5.71,50.8 6.98,50.8 8.26,50.8 9.53,50.8 10.79,50.8 12.06,50.8 13.33,50.8 14.6,50.8 15.87,50.8 17.14,50.8 18.41,50.8 19.69,50.8 3.17,52.07 4.44,52.07 5.71,52.07 6.98,52.07 8.26,52.07 9.53,52.07 10.79,52.07 12.06,52.07 13.33,52.07 14.6,52.07 15.87,52.07 17.14,52.07 18.41,52.07 19.69,52.07 3.17,53.34 4.44,53.34 5.71,53.34 6.98,53.34 8.26,53.34 9.53,53.34 10.79,53.34 12.06,53.34 13.33,53.34 14.6,53.34 15.87,53.34 17.14,53.34 18.41,53.34 19.69,53.34 3.17,54.61 4.44,54.61 5.71,54.61 6.98,54.61 8.26,54.61 9.53,54.61 10.79,54.61 12.06,54.61 13.33,54.61 14.6,54.61 15.87,54.61 17.14,54.61 18.41,54.61 19.69,54.61 3.17,55.88 4.44,55.88 5.71,55.88 6.98,55.88 8.26,55.88 9.53,55.88 10.79,55.88 12.06,55.88 13.33,55.88 14.6,55.88 15.87,55.88 17.14,55.88 18.41,55.88 19.69,55.88 3.17,57.15 4.44,57.15 5.71,57.15 6.98,57.15 8.26,57.15 9.53,57.15 10.79,57.15 12.06,57.15 13.33,57.15 14.6,57.15 15.87,57.15 17.14,57.15 18.41,57.15 19.69,57.15 3.17,58.42 4.44,58.42 5.71,58.42 6.98,58.42 8.26,58.42 9.53,58.42 10.79,58.42 12.06,58.42 13.33,58.42 14.6,58.42 15.87,58.42 17.14,58.42 18.41,58.42 19.69,58.42 3.17,59.69 4.44,59.69 5.71,59.69 6.98,59.69 8.26,59.69 9.53,59.69 10.79,59.69 12.06,59.69 13.33,59.69 14.6,59.69 15.87,59.69 17.14,59.69 18.41,59.69 19.69,59.69 3.17,60.96 4.44,60.96 5.71,60.96 6.98,60.96 8.26,60.96 9.53,60.96 10.79,60.96 12.06,60.96 13.33,60.96 14.6,60.96 15.87,60.96 17.14,60.96 18.41,60.96 3.17,62.23 4.44,62.23 5.71,62.23 6.98,62.23 8.26,62.23 9.53,62.23 10.79,62.23 12.06,62.23 13.33,62.23 14.6,62.23 15.87,62.23 17.14,62.23 18.41,62.23 19.69,62.23 4.44,63.5 5.71,63.5 6.98,63.5 8.26,63.5 9.53,63.5 10.79,63.5 12.06,63.5 13.33,63.5 14.6,63.5 15.87,63.5 17.14,63.5 18.41,63.5 19.69,63.5 5.71,64.77 6.98,64.77 8.26,64.77 9.53,64.77 10.79,64.77 12.06,64.77 13.33,64.77 14.6,64.77 15.87,64.77 17.14,64.77 18.41,64.77 19.69,64.77 6.98,66.04 8.26,66.04 9.53,66.04 10.79,66.04 12.06,66.04 13.33,66.04 14.6,66.04 15.87,66.04 17.14,66.04 18.41,66.04 19.69,66.04 8.26,67.31 9.53,67.31 10.79,67.31 12.06,67.31 14.6,67.31 15.87,67.31 17.14,67.31 18.41,67.31 19.69,67.31 8.26,68.58 9.53,68.58 10.79,68.58 15.87,68.58 17.14,68.58 18.41,68.58 19.69,68.58 8.26,69.85 9.53,69.85 10.79,69.85 15.87,69.85 17.14,69.85 18.41,69.85 19.69,69.85 8.26,71.12 9.53,71.12 10.79,71.12 12.06,71.12 14.6,71.12 15.87,71.12 17.14,71.12 18.41,71.12 19.69,71.12 8.26,72.39 9.53,72.39 10.79,72.39 12.06,72.39 13.33,72.39 14.6,72.39 15.87,72.39 17.14,72.39 18.41,72.39 19.69,72.39 8.26,73.66 9.53,73.66 10.79,73.66 12.06,73.66 13.33,73.66 14.6,73.66 15.87,73.66 17.14,73.66 18.41,73.66 19.69,73.66 8.26,74.93 9.53,74.93 10.79,74.93 12.06,74.93 13.33,74.93 14.6,74.93 15.87,74.93 17.14,74.93 18.41,74.93 19.69,74.93 8.26,76.2 9.53,76.2 10.79,76.2 12.06,76.2 13.33,76.2 14.6,76.2 15.87,76.2 17.14,76.2 18.41,76.2 19.69,76.2 8.26,77.47 9.53,77.47 10.79,77.47 12.06,77.47 13.33,77.47 14.6,77.47 15.87,77.47 17.14,77.47 18.41,77.47 19.69,77.47 8.26,78.74 9.53,78.74 10.79,78.74 12.06,78.74 13.33,78.74 14.6,78.74 15.87,78.74 17.14,78.74 18.41,78.74 19.69,78.74 8.26,80.01 9.53,80.01 10.79,80.01 15.87,80.01 17.14,80.01 18.41,80.01 19.69,80.01 8.26,81.28 9.53,81.28 10.79,81.28 15.87,81.28 17.14,81.28 18.41,81.28 19.69,81.28 8.26,82.55 9.53,82.55 10.79,82.55 15.87,82.55 17.14,82.55 18.41,82.55 19.69,82.55 8.26,83.82 9.53,83.82 10.79,83.82 12.06,83.82 14.6,83.82 15.87,83.82 17.14,83.82 18.41,83.82 19.69,83.82 8.26,85.09 9.53,85.09 10.79,85.09 12.06,85.09 13.33,85.09 14.6,85.09 15.87,85.09 17.14,85.09 18.41,85.09 8.26,86.36 9.53,86.36 10.79,86.36 12.06,86.36 13.33,86.36 14.6,86.36 15.87,86.36 17.14,86.36 18.41,86.36 19.69,86.36 8.26,87.63 9.53,87.63 10.79,87.63 12.06,87.63 13.33,87.63 14.6,87.63 15.87,87.63 17.14,87.63 18.41,87.63 19.69,87.63 20.95,87.63 8.26,88.9 9.53,88.9 10.79,88.9 12.06,88.9 13.33,88.9 14.6,88.9 15.87,88.9 17.14,88.9 18.41,88.9 19.69,88.9 8.26,90.17 9.53,90.17 10.79,90.17 12.06,90.17 13.33,90.17 14.6,90.17 15.87,90.17 17.14,90.17 18.41,90.17 19.69,90.17 8.26,91.44 9.53,91.44 10.79,91.44 12.06,91.44 13.33,91.44 14.6,91.44 15.87,91.44 17.14,91.44 18.41,91.44 19.69,91.44
  pour Top (no thermals): 21.72,92.58 22.23,92.08 22.23,88.27 20.32,86.36 20.32,75.56 22.23,73.66 22.23,70.48 20.32,68.58 20.32,57.79 22.23,55.88 22.23,53.34 20.32,51.44 20.32,40.01 22.23,38.1 22.23,35.56 20.32,33.66 20.32,22.22 22.23,20.32 22.23,16.51 21.59,15.88 3.17,15.88 2.54,16.51 2.54,62.87 7.62,67.95 7.62,91.82 8.38,92.58
  pour Bottom (no thermals): 22.23,92.08 22.23,88.27 20.32,86.36 20.32,75.56 22.23,73.66 22.23,70.48 20.32,68.58 20.32,57.79 22.23,55.88 22.23,53.34 20.32,51.44 20.32,40.01 22.23,38.1 22.23,35.56 20.32,33.66 20.32,22.22 22.23,20.32 22.23,16.51 21.59,15.88 3.17,15.88 2.54,16.51 2.54,62.87 7.62,67.95 7.62,91.82 8.38,92.58 21.72,92.58
GND  (via drill 0.51)
  Top 0.203: R5.1 23.58,76.62 v24,76.2 | 54.61,75.7 v54.61,77.47 | T4.2 C3.2 59.82,76.84 v61.09,75.56 | IC9.4 29.84,31.17 v29.84,32.38 | T24.2 53.79,31.71 53.79,32.32 53.09,33.02 v53.09,33.15 | IC1.4 29.91,85.67 v29.84,85.73 | C2.2 v33.66,86.36 | IC2.4 32.39,80.64 v31.68,81.36 | C1.2 v29.84,78.74 | R7.1 38.95,76.62 v39.37,76.2 40.81,76.2 T1.2 | S1.2 46.8,75.88 v45.24,75.88 | T5.2 53.97,85.88 v53.97,87 | C8.2 v33.66,68.58 | IC5.4 29.91,67.89 v29.84,67.95 | IC6.4 v31.75,62.87 | 28.58,60.96 v29.84,60.96 | R33.1 39.16,58.84 v39.37,59.05 39.69,58.74 T11.2 | v45.09,58.42 45.43,58.08 S3.2 | v21.97,57.53 21.59,57.91 R32.1 | S3.1 54.78,60.16 v54.61,60.33 | T12.2 59.69,59.63 59.97,59.34 C9.2 59.81,58.93 v61.44,58.93 | T14.2 54.3,68.89 v53.97,69.22 | T19.2 53.09,51.2 v53.09,51.31 | T17.2 C12.2 60,40.64 v60.96,40.64 | S4.1 54.78,41.78 v54.74,41.78 | S4.2 45.27,40.3 v45.24,40.32 | T16.2 39.69,40.96 v39.37,41.28 37.81,41.28 R47.1 | IC8.4 v31.75,45.09 | C4.2 29.21,43.18 v29.84,42.55 | v22.1,39.62 21.59,40.13 R46.1 | IC7.4 29.91,50.11 v29.84,50.16 | C5.2 v33.66,50.8 | T34.2 54.3,14.92 v53.97,15.24 | IC13.4 31.12,13.91 v31.12,15.88 | C20.2 34.93,15.24 v34.29,15.88 | IC14.4 33.59,8.89 v32.38,8.89 | C19.2 30.1,6.31 v30.1,5.97 | R90.1 23.91,5.5 v24.13,5.71 | R91.1 37.17,5.71 v38.73,5.71 39.05,5.4 T31.2 | S7.2 46.79,4.7 v45.34,4.7 | S7.1 54.78,6.06 v54.74,6.1 | T32.2 C21.2 60.96,4.12 v60.96,2.54 | v64.77,5.77 64.77,7.04 R17.1 | R61.1 37.88,23.28 v38.1,23.49 38.41,23.18 T21.2 | S5.2 44.64,22.51 v44.61,22.54 | v53.97,24.13 53.97,22.68 S5.1 | T22.2 C15.2 58.89,22.7 v60.48,22.7 | C14.2 v33.66,33.02 | IC10.4 32.31,27.3 v31.57,26.57 | 28.58,25.4 28.83,25.4 v29.46,24.76
  Top 0.203: R60.1 23.08,23.28 v23.5,22.86 | R15.1 64.14,43.01 64.14,41.4 v64.01,41.28 | v64.26,59.18 64.26,60.57 R14.1 | R66.1 64.03,77.2 v64.2,77.03 | R16.1 64.03,23.72 v64.23,23.53
  Top 0.406: C7.2 28.58,60.96 | 28.58,25.4 C13.2
  pour Top (rank 2, no thermals): -33.02,118.75 -33.02,-60.33 -31.75,-61.59 162.56,-61.59 163.83,-60.33 163.83,113.03 163.19,113.67 158.12,118.75
  pour Bottom (rank 2, no thermals): -24.13,113.03 -24.13,-53.97 -22.86,-55.24 147.96,-55.24 151.13,-52.07 154.94,-48.26 154.94,109.86 151.77,113.03
N53
  Top 0.203: IC5.3 28.07,65.41 26.67,66.8 26.67,71.75 | R37.1 50.8,67.53 | R39.1 50.8,67.53 | 50.8,67.53 50.8,70.48
  pour Top (no thermals): 26.16,74.93 25.91,74.68 25.91,70.23 26.29,69.85 67.31,69.85 67.95,70.48 67.95,74.3 67.31,74.93
N$1
  Top 0.203: R14.2 62.43,60.7 LED2.C
N$2
  Top 0.203: R2.1 31.75,80.01 31.12,80.64 IC1.1 IC1.2
N$3
  Top 0.203: IC1.6 IC1.7 21.8,81.92 R3.1
N$4
  Top 0.203: IC2.1 33.72,84.33 35.05,84.33 36.07,83.31 36.07,80.52 | IC2.5 38.67,80.52 36.07,80.52 | R4.1 35.05,78.45 35.05,79.5 36.07,80.52
N$5
  Top 0.203: R8.1 41.91,79.2 T1.1
N$6
  Top 0.203: IC2.7 38.92,83.31 40.26,83.31 41.05,84.11 41.05,84.23 41.23,84.41 42.59,84.41 42.77,84.23 42.77,82.98 42.59,82.8 42.58,82.8 R8.2
N$7
  Top 0.203: R7.2 38.52,79.38 39.75,79.38 40.39,80.01 40.39,81.66 40.13,81.92 | 40.13,81.92 IC2.6 | R6.1 41.24,82.94 41.23,82.94 40.21,81.92 40.13,81.92
N$8
  Top 0.203: R5.2 R3.2 22.65,80.43 23.5,81.28 27.3,81.28 28.55,82.52 31.64,82.52 32.12,82.04 33.47,82.04 IC2.3
N$9
  Top 0.203: R2.2 33.66,76.62 | 33.66,76.62 R4.2 | 33.66,76.62 33.4,76.87 33.4,79.12 34.32,80.04 34.82,80.04 35,80.22 35,80.34 35.31,80.64 35.31,82.93 35.05,83.19 IC2.2
N$10
  Top 0.203: R15.2 62.24,43.03 LED3.C
N$11
  Top 0.203: R12.1 50.8,85.31 | 50.8,85.31 R10.1 | IC1.3 27.94,83.19 26.04,85.09 26.04,90.17 | 50.8,85.31 50.8,87.63 50.8,88.9
  pour Top (no thermals): 26.16,92.71 25.91,92.46 25.91,88.01 26.29,87.63 67.31,87.63 67.95,88.27 67.95,92.08 67.31,92.71
N$12
  Top 0.203: R10.2 55,83.61 T5.3 55.25,86.36 55.88,87 71.75,87 72.39,87.63 72.39,88.27 T3.1
N$13
  Top 0.203: LED4.C 62.27,25.18 R16.2
N$14
  Top 0.203: T5.1 T2.3 59.22,85.73 60.96,85.73 61.34,85.34 R11.2
N$15
  Top 0.203: C3.1 T4.1 58.67,80.11 59.68,80.11 61.49,81.92 R13.2
N$16
  Top 0.203: R17.2 62.97,4.82 LED5.C
N$18
  Top 0.203: T4.3 60,82.7 T2.2 60,84.14 59.69,84.45 57.57,84.45 57.3,84.18 57.3,83.46 56.19,82.35 54.62,82.35 54.55,82.42 50.71,82.42 R12.2
N$27
  Top 0.203: R66.2 62.43,78.51 LED1.C
N$30
  Top 0.203: R29.1 29.95,62.34 29.91,62.39 IC5.1 IC5.2
N$31
  Top 0.203: IC5.6 IC5.7 21.8,64.14 R30.1
N$32
  Top 0.203: R33.2 39.46,60.54 40.64,61.72 40.64,63.75 40.13,64.26 39.75,64.26 | 38.1,64.14 IC6.6 39.62,64.14 39.75,64.26 | 38.1,64.14 37.47,64.14 37.08,64.52 37.08,65.79 37.34,66.04 41.7,66.04 R35.1 | 39.75,64.26 38.23,64.26 38.1,64.14
N$33
  Top 0.203: R32.2 R30.2 22.44,63.5 27.3,63.5 28.55,64.74 31.13,64.74 31.86,64.01 33.47,64.01 IC6.3
N$34
  Top 0.203: R29.2 33.4,58.84 | 33.4,58.84 R31.2 | IC6.2 34.54,65.41 35.31,64.64 35.31,62.8 35,62.5 35,62.44 33.4,60.84 33.4,58.84
N$35
  Top 0.203: IC6.1 33.72,66.55 35.05,66.55 35.94,65.66 35.94,62.48 | IC6.5 36.32,62.87 35.94,62.48 | R31.1 35.18,60.79 35.18,61.72 35.94,62.48
N$36
  Top 0.203: R34.1 41.91,61.11 T11.1
N$37
  Top 0.203: R34.2 41.24,65.02 41.23,65.02 40.85,65.41 IC6.7
N$39
  Top 0.203: R37.2 50.38,66.67 54.14,66.67 T14.3 55.25,68.58 55.88,69.22 71.75,69.22 72.39,69.85 T15.1
N$40
  Top 0.203: T14.1 T13.3 59.22,67.95 61.09,67.95 61.72,67.31 R38.2
N$41
  Top 0.203: C9.1 T12.1 58.89,62.23 59.69,62.23 61.44,63.98 R40.2
N$42
  Top 0.203: T12.3 60,64.6 T13.2 58.91,66.67 57.53,66.67 56.05,65.19 56.05,64.75 55.87,64.57 53.41,64.57 52.16,65.83 R39.2
N$43
  Top 0.203: D3.C 46.72,62.23 | 46.72,62.23 46.72,62.58 S3.4 | R41.2 46.83,65.66 S3.4 | S3.4 S3.3 54.95,62.58 57.95,65.58 T13.1 | S3.4 46.83,62.34 46.72,62.23
N$44
  Top 0.203: T11.3 43.81,59.86 43.81,60.96 D3.A 44.72,65.55 R36.2
N$45
  Top 0.203: IC7.2 IC7.1 30.03,44.96 30.03,44.14 31.41,42.76 R43.1
N$46
  Top 0.203: IC7.6 IC7.7 23.37,46.36 23.11,46.61 21.63,46.61 R44.1
N$47
  Top 0.203: R47.2 39.31,44.48 40.02,44.48 40.51,44.97 40.51,46.23 40.39,46.36 40.21,46.36 | IC8.6 40.21,46.36 | R49.1 41.24,47.38 41.23,47.38 40.21,46.36
N$48
  Top 0.203: R46.2 R44.2 22.44,45.72 26.92,45.72 28.16,46.96 31.13,46.96 31.61,46.48 32.38,46.48 32.51,46.36 IC8.3
N$49
  Top 0.203: R43.2 33.4,41.06 | 33.4,41.06 R45.2 | IC8.2 35.05,47.62 35.43,47.24 35.43,44.96 33.4,42.93 33.4,41.06
N$50
  Top 0.203: IC8.5 38.67,44.96 37.12,44.96 37.04,44.88 | R45.1 37.04,44.88 | 37.04,44.88 36.58,45.34 36.58,47.75 35.53,48.8 34.93,48.8 33.69,48.8 IC8.1
N$51
  Top 0.203: T16.1 41.91,43.96 R48.1
N$52
  Top 0.203: IC8.7 38.92,47.75 40.14,47.75 41.23,48.85 42.59,48.85 43.18,48.26 43.18,46.99 42.76,46.57 R48.2
N$53
  Top 0.203: IC7.3 29.24,48.29 28.68,48.29 26.67,50.3 26.67,53.98 | R51.1 R53.1 52.07,52.71
  pour Top (no thermals): 26.16,57.15 25.91,56.9 25.91,52.45 26.29,52.07 67.31,52.07 67.95,52.71 67.95,56.52 67.31,57.15
N$54
  Top 0.203: R51.2 50.38,48.9 54.61,48.9 55.25,48.26 T19.3 55.25,50.8 55.88,51.44 71.75,51.44 72.39,52.07 72.39,53.34 72.39,53.98 T20.1
N$55
  Top 0.203: T19.1 T18.3 62.32,50 R52.2
N$56
  Top 0.203: C12.1 T17.1 58.57,44.45 59.69,44.45 61.59,46.36 R54.2
N$57
  Top 0.203: R53.2 52.28,48.05 53.54,46.79 56.06,46.79 57.3,48.03 57.3,48.62 57.57,48.9 59.82,48.9 60,48.71 T18.2 60,47.14 T17.3
N$58
  Top 0.203: 46.83,45.59 S4.4 | 46.72,45.49 46.68,45.45 47.34,44.8 S4.3 55.84,44.8 58.11,47.06 T18.1 | R55.2 46.99,45.76 46.83,45.59 | D4.C 46.72,45.49 | 46.72,45.49 46.83,45.59
N$59
  Top 0.203: T16.3 43.01,42.63 43.56,43.18 D4.A 44.45,43.45 R50.2
N$60
  Top 0.203: R57.1 29.91,26.19 IC9.1 IC9.2
N$61
  Top 0.203: R58.1 24.49,28.79 IC9.7 IC9.6
N$62
  Top 0.203: R61.2 38.19,24.98 39.91,26.7 40.02,26.7 40.26,26.94 40.26,28.45 | 40.26,28.45 40.13,28.57 IC10.6 | 40.26,28.45 40.26,29.84 40.77,30.35 41.27,30.35
N$63
  Top 0.203: IC10.3 32.38,28.57 31.75,29.21 27.3,29.21 26.04,27.94 22.44,27.94 R58.2 R60.2
N$64
  Top 0.203: IC10.2 34.93,29.84 35.43,29.34 35.43,27.18 34.8,26.54 32.51,26.54 32.38,26.42 32.38,23.24 | 32.38,23.24 31.15,23.24 R57.2 | R59.2 32.42,23.28 32.38,23.24
N$65
  Top 0.203: IC10.5 38.77,27.27 36.86,27.27 36.2,27.94 | IC10.1 35.56,31.11 36.2,30.48 36.2,27.94 | 36.2,27.94 36.2,26.67 35.56,26.04 34.16,26.04 33.66,25.53 R59.1
N$66
  Top 0.203: T21.1 41.27,26.18 R62.1
N$67
  Top 0.203: IC10.7 39.46,30.51 40.02,30.51 40.65,31.14 41.06,31.14 41.09,31.11 42.16,31.11 42.42,30.86 42.42,29.21 42,28.79 R62.2
N$68
  Top 0.203: IC9.3 27.3,29.84 26.67,30.48 26.67,36.57 | R65.1 50.17,31.96 | R68.1 50.17,31.96 | 50.17,31.96 50.17,34.92
  pour Top (no thermals): 26.16,39.37 25.91,39.12 25.91,34.67 26.29,34.29 67.31,34.29 67.95,34.92 67.95,38.73 67.31,39.37
N$69
  Top 0.203: R65.2 49.75,31.11 52.07,31.11 53.81,29.38 T24.3 54.61,33.02 55.25,33.66 68.58,33.66 70.61,35.69 72.39,35.69 T25.1
N$70
  Top 0.203: T24.1 55.64,31.66 58.42,31.66 | R67.2 62.16,31.58 58.8,31.58 | 58.8,31.58 T23.3 58.42,31.66 | 58.42,31.66 58.72,31.66 58.8,31.58
N$71
  Top 0.203: C15.1 T22.1 57.94,26.04 59.95,26.04 R70.2
N$72
  Top 0.203: 59.3,29.45 T23.2 | T22.3 57.78,27.94 59.3,29.45 | R68.2 53.33,28.38 55.24,28.38 56.67,29.8 56.67,30.21 57.03,30.57 58.8,30.57 59.3,30.08 59.3,29.45
N$73
  Top 0.203: D5.C 46.19,25.5 S5.4 | R71.2 46.19,30.1 S5.4 | S5.4 S5.3 55.11,27.01 T23.1
N$74
  Top 0.203: R64.2 44.09,29.99 D5.A 42.38,25.4 T21.3
N$76
  Top 0.203: S1.4 46.83,81.15 46.68,81.01 46.72,80.97 D1.C | T2.1 58.11,83 55.88,80.77 55.63,80.77 | 55.63,80.77 55.25,80.77 | 55.25,80.77 54.48,80.77 54.78,80.48 S1.3 | S1.4 47.69,81.22 54.8,81.22 | S1.4 46.83,83.44 R69.2 | 54.8,81.22 55.25,80.77 | 54.8,81.22 55.18,81.22 55.63,80.77
N$77
  Top 0.203: T1.3 43.81,77.96 43.81,78.36 44.2,78.74 D1.A 44.72,83.34 R9.2
N$92
  Top 0.203: R87.1 30.54,8.41 IC13.1 IC13.2
N$93
  Top 0.203: IC13.6 IC13.7 22.44,10.79 R88.1
N$94
  Top 0.203: R91.2 38.94,7.2 40.84,9.1 40.84,10.6 40.64,10.79 IC14.6 38.23,10.79 37.85,11.18 37.85,12.31 38.23,12.7 40.64,12.7 41.7,12.7 R93.1
N$95
  Top 0.203: R90.2 R88.2 23.08,10.16 27.3,10.16 28.58,11.43 31.75,11.43 32.38,10.79 IC14.3
N$96
  Top 0.203: R87.2 R89.2 33.27,6.52 33.27,7.87 33.66,8.26 35.05,8.26 35.81,9.02 35.81,11.43 35.18,12.07 IC14.2
N$97
  Top 0.203: R89.1 34.33,7.16 34.84,7.16 36.83,9.14 | IC14.5 39.3,9.4 39.18,9.53 37.85,9.53 37.47,9.14 36.83,9.14 | IC14.1 36.2,13.34 36.83,12.7 36.83,9.14
N$98
  Top 0.203: T31.1 40.95,7.3 41.91,8.26 R92.1
N$99
  Top 0.203: IC14.7 40.77,12.07 41.82,11.01 R92.2
N$100
  Top 0.203: IC13.3 29.88,12.73 29.31,12.73 26.67,15.37 26.67,18.41 | R95.1 50.8,14.19 | 50.8,14.19 R97.1 | 50.8,14.19 50.8,17.78
  pour Top (no thermals): 26.8,21.59 26.54,21.34 26.54,16.89 26.92,16.51 67.95,16.51 68.58,17.14 68.58,20.95 67.95,21.59
N$101
  Top 0.203: R95.2 50.46,12.49 51.26,13.29 52.75,13.29 54.44,11.6 T34.3 55.25,14.86 56.26,15.88 72.52,15.88 73.15,16.51 73.15,19.17 T35.1
N$102
  Top 0.203: R96.2 61.12,13.81 60.96,13.97 59.22,13.97 T33.3 T34.1
N$103
  Top 0.203: T32.1 C21.1 59.06,6.03 59.06,7.84 59.38,8.16 59.59,8.16 61.91,10.48 R98.2
N$104
  Top 0.203: 59.95,11.55 59.94,11.54 59.94,11.94 59.18,12.7 57.57,12.7 56.77,11.9 56.77,11.18 56.01,10.41 54.14,10.41 R97.2 | 59.95,11.55 T33.2 | T32.3 59.06,9.53 59.95,10.42 59.95,11.55
N$105
  Top 0.203: D7.C 46.72,9.13 S7.4 | T33.1 58.11,10.48 56.86,9.23 S7.3 S7.4 | R99.2 46.99,9.4 S7.4
N$106
  Top 0.203: T31.3 43.81,6.35 44.72,7.25 D7.A 44.72,12.21 R94.2
OUT1
  Top 0.203: R11.1 63.97,85.28 63.97,83.19 64.03,83.19 | 64.03,83.19 R13.1 | LED1.A 67.63,75.88 | 64.03,83.19 67.31,83.19
  Top 4.724: 70.48,80.37 70.48,80.64
  pour Top (no thermals): 66.67,85.09 73.15,85.09 73.28,84.96 73.28,81.92 78.74,76.45 78.74,74.3 78.74,73.03 80.01,71.75 80.9,71.75 88.27,71.75 88.9,71.75 89.53,71.12 89.53,66.67 88.9,66.04 77.47,66.04 76.84,66.67 73.15,70.36 73.15,73.28 73.15,74.42 72.52,75.06 72.01,75.56 66.55,75.56 66.55,85.09
OUT2
  Top 0.203: R38.1 64.03,65.41 | 64.03,65.41 R40.1 | 64.03,65.41 68.58,65.41 | LED2.A 67.63,57.98
  pour Top (no thermals): 66.55,57.79 74.3,57.79 76.2,55.88 88.9,55.88 89.53,56.52 89.53,60.96 88.9,61.59 79.38,61.59 73.79,67.18 66.55,67.18
OUT3
  Top 0.203: R54.1 64.03,47.62 | R52.1 64.03,47.62 | 64.03,47.62 66.67,47.62 | LED3.A 67.44,40.1
  pour Top (no thermals): 66.67,40.01 73.15,40.01 73.28,40.13 73.28,44.7 74.3,45.72 78.49,45.72 88.39,45.72 88.9,45.72 89.53,46.36 89.53,50.8 88.9,51.44 72.39,51.44 71.12,50.16 70.48,49.53 69.85,49.53 66.55,49.53 66.55,40.39 66.55,40.01
OUT4
  Top 0.203: R67.1 64.03,29.21 | 64.03,29.21 R70.1 | LED4.A 65.52,22.38 67.27,24.13 67.31,24.13 | 64.03,29.21 66.67,29.21
  pour Top (no thermals): 66.55,22.22 73.53,22.22 73.53,28.45 78.11,33.02 78.11,33.66 80.01,35.56 88.9,35.56 89.53,36.2 89.53,40.64 88.9,41.28 78.11,41.28 73.28,36.45 73.28,35.05 73.15,34.92 71.63,34.92 68.33,31.62 66.55,31.62
OUT5
  Top 0.203: R96.1 64.67,11.43 | 64.67,11.43 R98.1 | 64.67,11.43 67.95,11.43 | LED5.A 68.58,4.6
  pour Top (no thermals): 67.31,3.81 74.3,3.81 74.3,8.89 79.38,13.97 79.38,22.22 78.61,22.99 78.61,24.64 79.38,25.4 88.9,25.4 89.53,26.04 89.53,30.48 88.9,31.11 77.47,31.11 74.04,27.69 74.04,16.89 71.75,14.61 67.31,14.61 66.67,13.97 66.67,4.45

### Text on the board
tPlace: GND | 12V | Cartesian Robotics | FRC #8561 | GND | 12V | GND | 12V | GND | 12V | GND | 12V | GND | 12V | Power / Distribution / Board